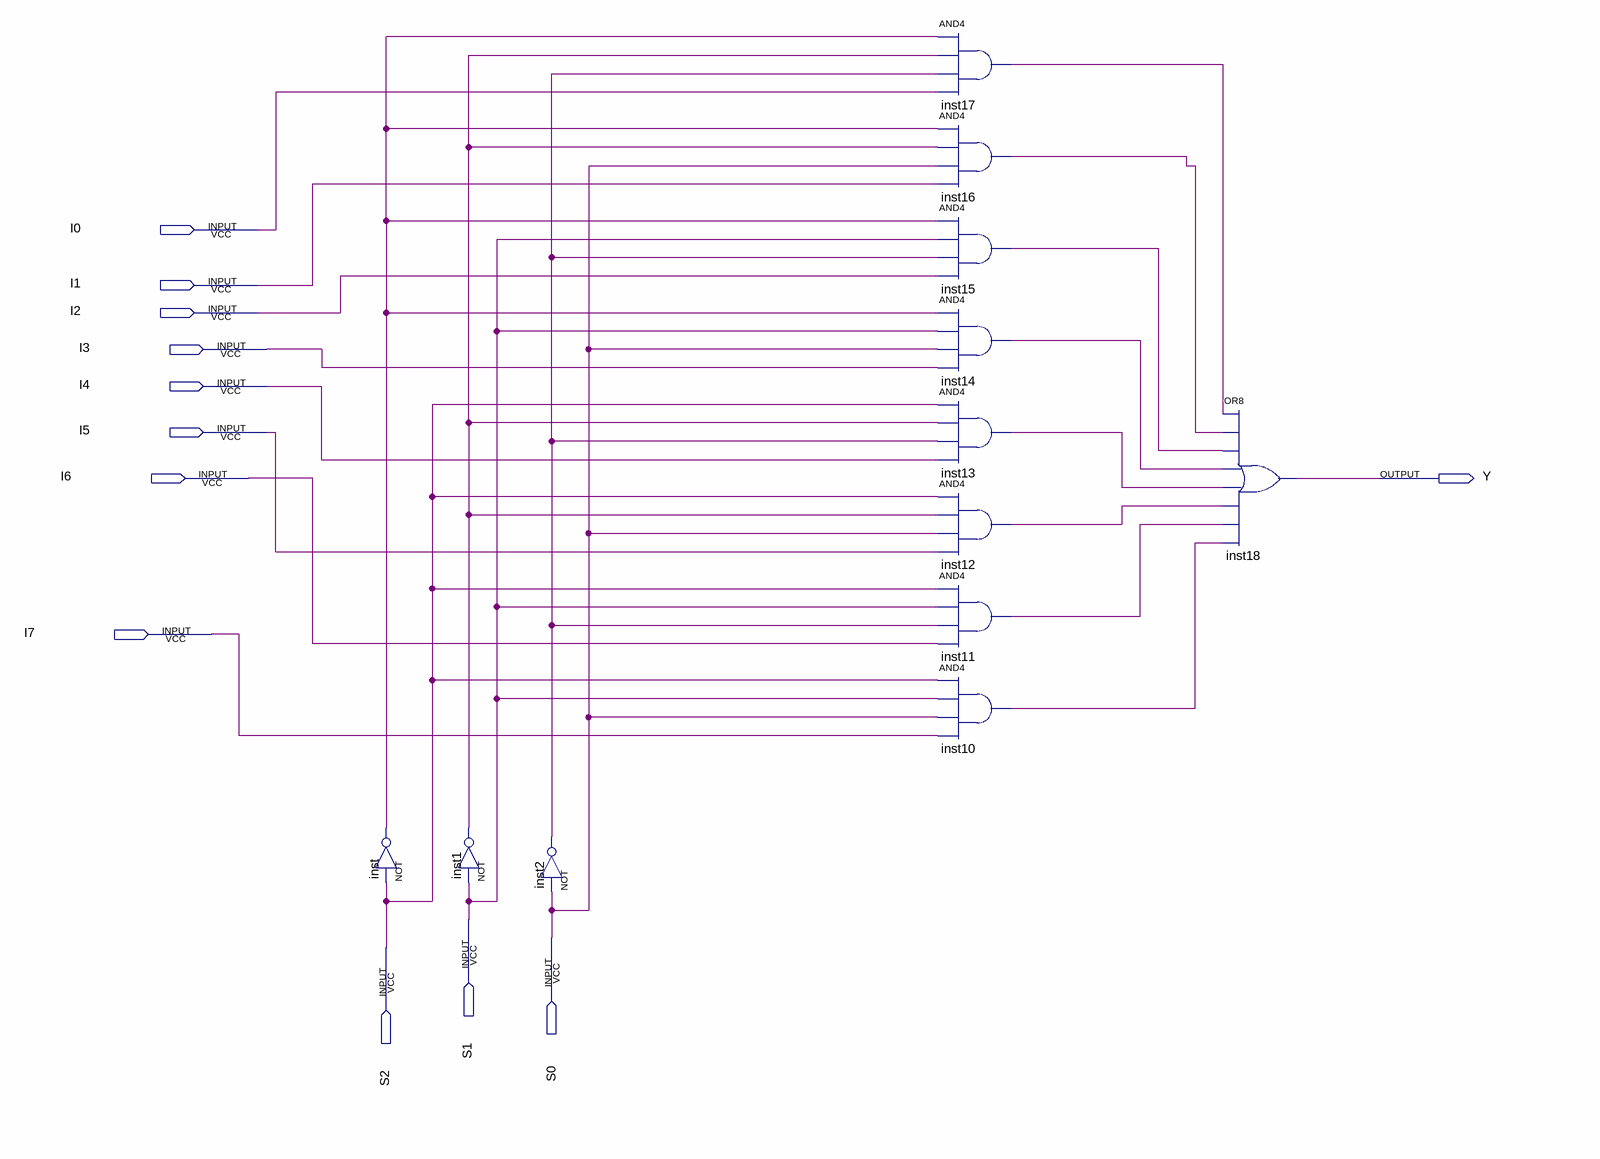
[diagram p0: schematic sheet]
// Quartus schematic mux8to1.bdf as structural Verilog: 12 symbols, 12 pins
module mux8to1 (
  input  I0,
  input  I1,
  input  I2,
  input  I3,
  input  I4,
  input  I5,
  input  I6,
  input  I7,
  input  S1,
  input  S0,
  input  S2,
  output Y
);

  wire inst1_out, inst2_out, inst10_out, inst11_out, inst12_out, inst13_out, inst14_out, inst15_out,
       inst16_out, inst17_out, inst_out;

  not inst (inst_out, S2);
  not inst1 (inst1_out, S1);
  not inst2 (inst2_out, S0);
  and inst17 (inst17_out, inst_out, inst1_out, inst2_out, I0);
  and inst16 (inst16_out, inst_out, inst1_out, S0, I1);
  and inst15 (inst15_out, inst_out, S1, inst2_out, I2);
  and inst14 (inst14_out, inst_out, S1, S0, I3);
  and inst13 (inst13_out, S2, inst1_out, inst2_out, I4);
  and inst12 (inst12_out, S2, inst1_out, S0, I5);
  and inst11 (inst11_out, S2, S1, inst2_out, I6);
  and inst10 (inst10_out, S2, S1, S0, I7);
  or inst18 (Y, inst17_out, inst16_out, inst15_out, inst14_out, inst13_out, inst12_out, inst11_out, inst10_out);
endmodule
